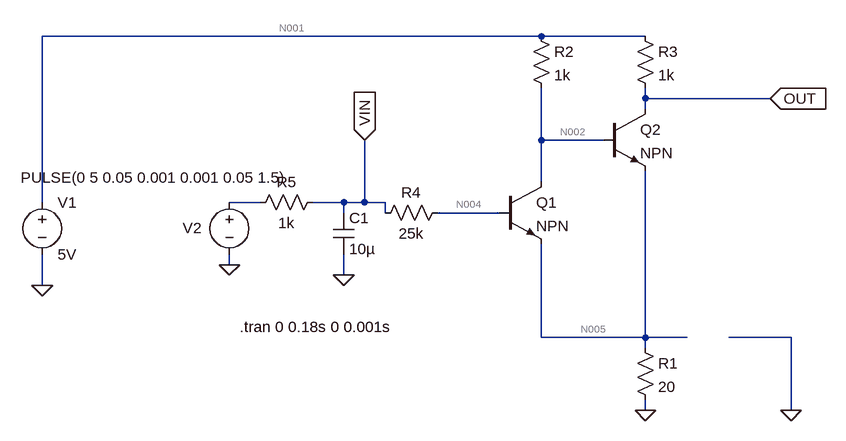
[diagram p0: schematic schemat3.asc]
schemat3.asc, the LTspice schematic file:
Version 4
SHEET 1 880 692
WIRE 32 96 -736 96
WIRE 192 96 32 96
WIRE 192 192 192 176
WIRE 384 192 192 192
WIRE 192 208 192 192
WIRE 32 256 32 176
WIRE 128 256 32 256
WIRE 32 320 32 256
WIRE -736 352 -736 96
WIRE -400 352 -448 352
WIRE -272 352 -320 352
WIRE -240 352 -240 256
WIRE -240 352 -272 352
WIRE -208 352 -240 352
WIRE -272 368 -272 352
WIRE -208 368 -208 352
WIRE -32 368 -128 368
WIRE -448 448 -448 432
WIRE -272 464 -272 432
WIRE -736 480 -736 432
WIRE 32 560 32 416
WIRE 192 560 192 304
WIRE 192 560 32 560
WIRE 256 560 192 560
WIRE 416 560 320 560
WIRE 192 576 192 560
WIRE 192 672 192 656
WIRE 416 672 416 560
FLAG -448 448 0
FLAG -240 256 VIN
IOPIN -240 256 In
FLAG 192 672 0
FLAG -736 480 0
FLAG 384 192 OUT
IOPIN 384 192 In
FLAG -272 464 0
FLAG 416 672 0
SYMBOL voltage -448 336 R0
WINDOW 0 -72 55 Left 2
WINDOW 3 -321 -22 Left 2
WINDOW 123 0 0 Left 0
WINDOW 39 0 0 Left 0
SYMATTR InstName V2
SYMATTR Value PULSE(0 5 0.05 0.001 0.001 0.05 1.5)
SYMBOL npn -32 320 R0
SYMATTR InstName Q1
SYMBOL res 176 560 R0
SYMATTR InstName R1
SYMATTR Value 20
SYMBOL npn 128 208 R0
SYMATTR InstName Q2
SYMBOL res 16 80 R0
SYMATTR InstName R2
SYMATTR Value 1k
SYMBOL res 176 80 R0
SYMATTR InstName R3
SYMATTR Value 1k
SYMBOL voltage -736 336 R0
WINDOW 123 0 0 Left 0
WINDOW 39 0 0 Left 0
SYMATTR InstName V1
SYMATTR Value 5V
SYMBOL res -112 352 R90
WINDOW 0 0 56 VBottom 2
WINDOW 3 32 56 VTop 2
SYMATTR InstName R4
SYMATTR Value 25k
SYMBOL res -304 336 R90
WINDOW 0 0 56 VBottom 2
WINDOW 3 32 56 VTop 2
SYMATTR InstName R5
SYMATTR Value 1k
SYMBOL cap -288 368 R0
SYMATTR InstName C1
SYMATTR Value 10µ
TEXT -432 544 Left 2 !.tran 0 0.18s 0 0.001s

The netlist it stands for:
* schemat3.asc
V2 N003 0 PULSE(0 5 0.05 0.001 0.001 0.05 1.5)
Q1 N002 N004 N005 0 NPN
R1 N005 0 20
Q2 OUT N002 N005 0 NPN
R2 N001 N002 1k
R3 N001 OUT 1k
V1 N001 0 5V
R4 N004 VIN 25k
R5 VIN N003 1k
C1 VIN 0 10µ
.model NPN NPN
.model PNP PNP
.lib standard.bjt
.tran 0 0.18s 0 0.001s
.backanno
.end

* Results of the author's LTspice run, read from the files saved beside the schematic
* Operating Point, zero values left out:
*   V(n002) = 1.015 V
*   V(n004) = 30.96 nV
*   V(n005) = 175.6 mV
*   V(out) = 206 mV
*   V(n001) = 5 V
*   Ic(Q1) = 1.015 pA
*   Ib(Q1) = -1.191 pA
*   Ic(Q2) = 4.794 mA
*   Ib(Q2) = 3.985 mA
*   Ie(Q2) = -8.779 mA
*   I(R1) = 8.779 mA
*   I(R2) = 3.985 mA
*   I(R3) = 4.794 mA
*   I(R4) = 1.191 pA
*   I(R5) = 1.191 pA
*   I(V2) = 1.191 pA
*   I(V1) = -8.779 mA
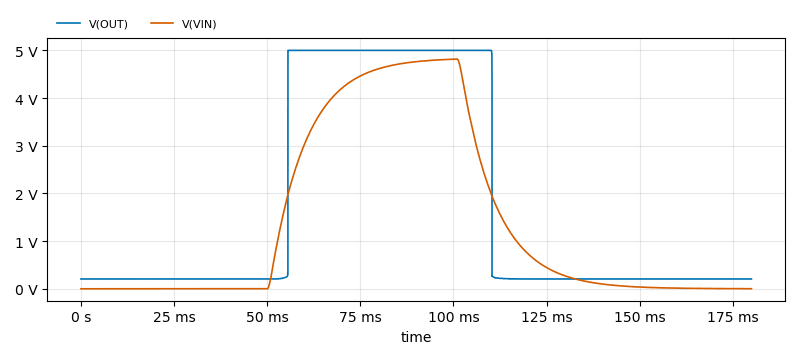
[diagram p1: Transient Analysis of schemat3.asc, plotted from the saved traces]
* Transient Analysis, 1 run:
*   V(OUT): min 206 mV, max 5 V, average 1.666 V, rms 2.764 V, last 206 mV
*   V(VIN): min 0 V, max 4.818 V, average 1.377 V, rms 2.326 V, last 1.807 mV